# EAGLE schematic untitled (EAGLE 6.4)
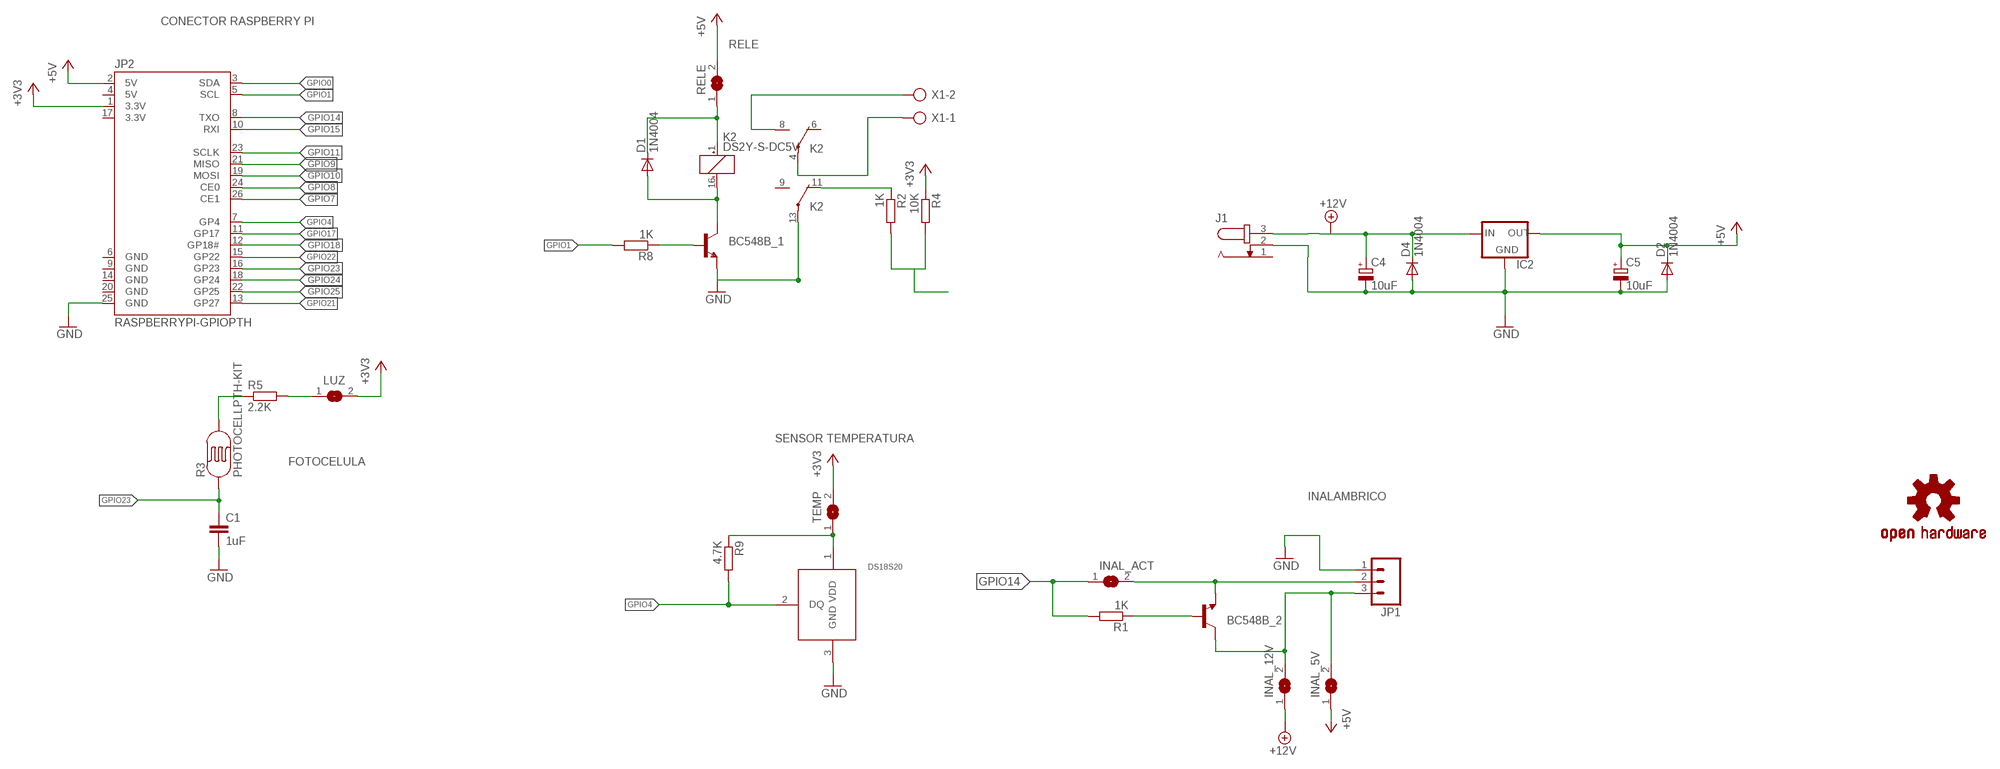
[diagram p0: schematic, sheet 1]

## Parts
BC548B_1  TRANSISTOR_NPNTO-92-AMMO  [TO-92-AMMO]
BC548B_2  TRANSISTOR_NPNTO-92-AMMO  [TO-92-AMMO]
C1  1uF  C5/3.5  [C5B3.5]
C4  10uF  CPOL-EUE2-5  [E2-5]
C5  10uF  CPOL-EUE2-5  [E2-5]
D1  1N4004  [DO41-10]
D2  1N4004  [DO41-10]
D4  1N4004  [DO41-10]
DS18S20  18S20  [TO-92]
IC2  78XXS  [78XXS]
INAL_5V  SJ  [SJ]
INAL_12V  SJ  [SJ]
INAL_ACT  SJ  [SJ]
J1  JACK-PLUG0  [SPC4077]
JP1  M03POLAR  [MOLEX-1X3]
JP2  RASPBERRYPI-GPIOPTH  [2X13-SHROUDED]
K2  DS2Y-S-DC5V  [DS2Y]
LUZ  SJ  [SJ]
R1  1K  R-EU_0207/10  [0207/10]
R2  1K  R-EU_0207/10  [0207/10]
R3  PHOTOCELLPTH-KIT  [PHOTOCELL-KIT]
R4  10K  R-EU_0207/10  [0207/10]
R5  2.2K  R-EU_0207/10  [0207/10]
R8  1K  R-EU_0207/10  [0207/10]
R9  4.7K  R-EU_0207/10  [0207/10]
RELE  SJ  [SJ]
TEMP  SJ  [SJ]
U$1  OSHW-LOGOL  [OSHW-LOGO-L]
X1  AK500/2  [AK500/2]

## Nets
+3V3: JP2.1(3.3V) LUZ.2 R4.1 TEMP.2
+5V: C5.+ D2.C IC2.OUT INAL_5V.1 JP2.2(5V) RELE.2
+12V: C4.+ D4.C IC2.IN INAL_12V.1 J1.3
GND12: BC548B_1.1(E) C1.2 C4.- C5.- D2.A D4.A DS18S20.3(GND) IC2.GND J1.2 JP1.1 JP2.25(GND) K2.13(3:P) ; supply symbol labelled GND
GPIO0: JP2.3(SDA)
GPIO1: JP2.5(SCL) R8.2
GPIO4: DS18S20.2(DQ) JP2.7(GP4) R9.2
GPIO7: JP2.26(CE1)
GPIO8: JP2.24(CE0)
GPIO9: JP2.21(MISO)
GPIO10: JP2.19(MOSI)
GPIO11: JP2.23(SCLK)
GPIO14: INAL_ACT.1 JP2.8(TXO) R1.2
GPIO15: JP2.10(RXI)
GPIO17: JP2.11(GP17)
GPIO18: JP2.12(GP18#)
GPIO21: JP2.13(GP27)
GPIO22: JP2.15(GP22)
GPIO23: C1.1 JP2.16(GP23) R3.1
GPIO24: JP2.18(GP24)
GPIO25: JP2.22(GP25)
N$1: BC548B_1.3(C) D1.A K2.16(1:-)
N$2: DS18S20.1(VDD) R9.1 TEMP.1
N$3: R3.2 R5.1
N$4: BC548B_1.2(B) R8.1
N$5: BC548B_2.2(B) R1.1
N$6: K2.8(2:S) X1.2
N$7: BC548B_2.1(E) INAL_ACT.2 JP1.2
N$8: K2.11(3:O) R2.1
N$9: K2.4(2:P) X1.1
N$10: LUZ.1 R5.2
N$11: D1.C K2.1(1:+) RELE.1
N$12: R2.2 R4.2
N$14: BC548B_2.3(C) INAL_5V.2 INAL_12V.2 JP1.3
Unconnected: J1.1 K2.6(2:O) K2.9(3:S)

## Notes on the sheet
- CONECTOR RASPBERRY PI
- RELE
- SENSOR TEMPERATURA
- FOTOCELULA
- INALAMBRICO

## Power pins joined to a net without a drawn wire
3.3V: JP2.17(3.3V)
5V: JP2.4(5V)
GND12: JP2.6(GND) JP2.9(GND) JP2.14(GND) JP2.20(GND)

## Library data of the parts
BC548B_1 BC548B_2 = SparkFun:TRANSISTOR_NPN: Transistor NPN BJT configuration in SOT23 package. MMBT2222 is the common NPN we use. Double check BCE configuration again layout.
C1 = capacitor-wima:C: CAPACITOR naming: grid - package width
C4 C5 = resistor:CPOL-EU: POLARIZED CAPACITOR, European symbol
D1 D2 D4 = diode:1N4004: DIODE general purpose rectifier, 1 A
DS18S20 = merriman:18S20: Dallas/Maxim 18S20 1-Wire temperature sensor (including PAR, since assumes pin 3 NOT connected internally on that variant)
IC2 = v-reg:78XXS: VOLTAGE REGULATOR
INAL_5V INAL_12V INAL_ACT LUZ RELE TEMP = jumper:SJ: SMD solder JUMPER
J1 = con-jack:JACK-PLUG: DC POWER JACK Power Jack, DC, Right Angle, Through Hole, Rated 5A at 16VDC, PC Terminals Distributor: Farnell (www.Farnell.de) Drawing: 84N1161.pdf / 84N1162.pdf Manufacturer: SPC Technology (www.spctechnology.com) Type: SPC4077 / SPC 4078; OC_FARNELL: unknown; OC_NEWARK: unknown
JP1 = SparkFun:M03: Header 3 Standard 3-pin 0.1" header. Use with straight break away headers (SKU : PRT-00116), right angle break away headers (PRT-00553), swiss pins (PRT-00743), machine pins (PRT-00117), and female headers (PRT-00115). Molex polarized connector foot print use with SKU : PRT-08232 with associated crimp pins and housings.
JP2 = SparkFun-Boards:RASPBERRYPI-GPIO: RASPBERRY PI I/O HEADER As defined for the Revistion 2 Pi.; DIST: sparkfun; DIST_ID: PRT-11490
K2 = relay:DS2Y-S-DC*: MINIATURE RELAY NAiS Source: http://www.mew-europe.com/.. en_ds_61005_0023.pdf
R1 R2 R4 R5 R8 R9 = rcl:R-EU_: RESISTOR, European symbol
R3 = SparkFun:PHOTOCELL: Photocell Also known as a CdS photoresistor. This is a low cost way to detect light levels. Resistance decreases with more incoming light. SparkFun SKU: SEN-09088
U$1 = SparkFun:OSHW-LOGO: Open Source Hardware Logo This logo indicates the piece of hardware it is found on incorporates a OSHW license and/or adheres to the definition of open source hardware found here: http://freedomdefined.org/OSHW
X1 = con-ptr500:AK500/2: CONNECTOR

## Net classes
1 power: width 0.6 mm, clearance 0.3 mm